# Altium schematic sheet Bandpass.SchDoc
size A
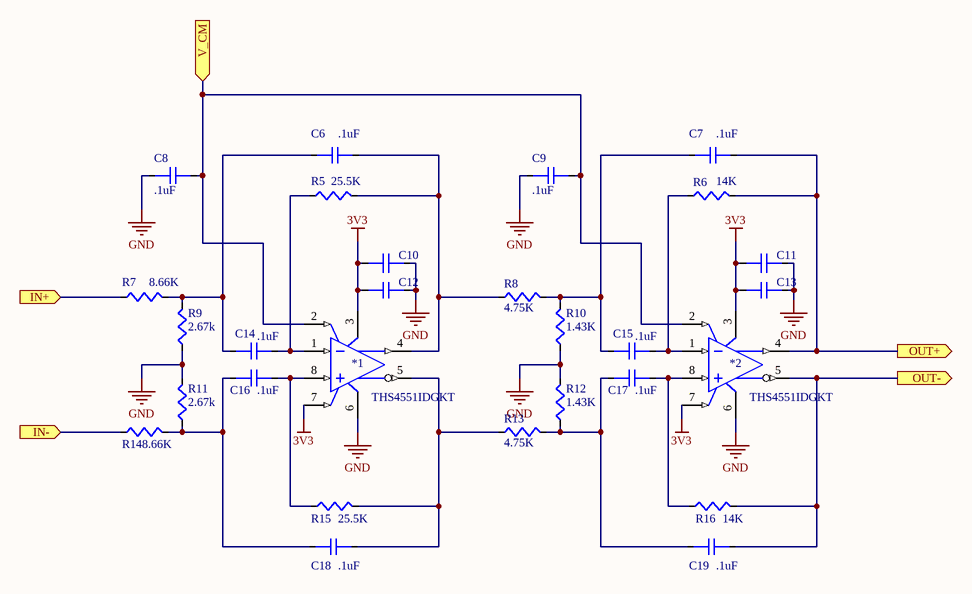
[diagram p0: Bandpass.SchDoc]

## Parts
*1  THS4551IDGKT
*2  THS4551IDGKT
C6  .1uF
C7  .1uF
C8  .1uF
C9  .1uF
C10  2.2uF  (value not drawn)
C11  2.2uF  (value not drawn)
C12  .1uF  (value not drawn)
C13  .1uF  (value not drawn)
C14  .1uF
C15  .1uF
C16  .1uF
C17  .1uF
C18  .1uF
C19  .1uF
R5  25.5K
R6  14K
R7  8.66K
R8  4.75K
R9  2.67k
R10  1.43K
R11  2.67k
R12  1.43K
R13  4.75K
R14  8.66K
R15  25.5K
R16  14K

## Ports
IN+ (in), IN- (in), OUT+ (out), OUT- (out), V_CM (in)

## Nets
3V3: *1.3(VS+) *1.7(~{PD}) *2.3(VS+) *2.7(~{PD}) C10.1 C11.1 C12.1 C13.1
GND: *1.6(VS-) *2.6(VS-) C8.1 C9.1 C10.2 C11.2 C12.2 C13.2 R9.1 R10.1 R11.2 R12.2
IN+: R7.1 ; port IN+
IN-: R14.1 ; port IN-
OUT+: *2.4(VOUT+) C7.2 R6.2 ; port OUT+
OUT-: *2.5(VOUT-) C19.2 R16.2 ; port OUT-
V_CM: *1.2(VOCM) *2.2(VOCM) C8.2 C9.2 ; port V_CM
Net*1_1: *1.1(VIN-) C14.2 R5.1
Net*1_4: *1.4(VOUT+) C6.2 R5.2 R8.1
Net*1_5: *1.5(VOUT-) C18.2 R13.1 R15.2
Net*1_8: *1.8(VIN+) C16.2 R15.1
Net*2_1: *2.1(VIN-) C15.2 R6.1
Net*2_8: *2.8(VIN+) C17.2 R16.1
NetC6_1: C6.1 C14.1 R7.2 R9.2
NetC7_1: C7.1 C15.1 R8.2 R10.2
NetC16_1: C16.1 C18.1 R11.1 R14.2
NetC17_1: C17.1 C19.1 R12.1 R13.2

## Library data of the parts
*1 *2 = THS4551IDGKT: Low Noise, Precision, 150MHz, Fully Differential Amplifier 8-VSSOP -40 to 125; Manufacturer 1: Texas Instruments; Number of Channels: 1; Slew Rate: 220V/µs; Output Current per Channel: 65mA; Gain Bandwidth Product: 135MHz; Input Bias Current: 1uA; Input Offset Voltage (Vos): 50uV; Operating Supply Current: 1.35mA; Supplier 1: Digi-Key; Supplier Part Number 1: 296-44771-1-ND; Manufacturer Part Number 1: THS4551IDGKT; Stock 1: 3028; Pricing 1: 1=3.84000, 10=3.44900, 100=2.82600 (USD); Mount: Surface Mount; Case/Package: VSSOP; Number of Pins: 8; Min Operating Temperature: -40°C; Max Operating Temperature: 125°C; -3db Bandwidth: 150MHz; Packaging: Cut Tape; Number of Circuits: 1; Number of Amplifiers: 1; Bandwidth: 135MHz; REACH SVHC: No SVHC; Lead Free: Lead Free; ComponentLink1URL: http://www.ti.com/lit/ds/symlink/ths4551.pdf?src-supplier=Digi-Key; ComponentLink1Description: http://www.ti.com/lit/ds/symlink/ths4551.pdf?src-supplier=Digi-Key; ComponentLink2URL: http://www.ti.com/general/docs/lit/getliterature.tsp?genericPartNumber=THS4551&fileType=pdf&src-supplier=Farnell; ComponentLink2Description: http://www.ti.com/general/docs/lit/getliterature.tsp?genericPartNumber=THS4551&fileType=pdf&src-supplier=Farnell; ComponentLink3URL: http://www.farnell.com/datasheets/2148327.pdf?src-supplier=Element14; ComponentLink3Description: http://www.farnell.com/datasheets/2148327.pdf?src-supplier=Element14; ComponentLink4URL: https://octopart.com/click/track?ai=2118&ct=datasheets&sig=0013830&at=physicalpart&sid=370&ppid=71776714&hlid=24961842&src-supplier=TI+store; ComponentLink4Description: https://octopart.com/click/track?ai=2118&ct=datasheets&sig=0013830&at=physicalpart&sid=370&ppid=71776714&hlid=24961842&src-supplier=TI+store; ComponentLink5URL: http://sigma.octopart.com/49250154/technical_drawing/Texas-Instruments-THS4551IDGKT.pdf?src-supplier=TI+store; ComponentLink5Description: http://sigma.octopart.com/49250154/technical_drawing/Texas-Instruments-THS4551IDGKT.pdf?src-supplier=TI+store; ComponentLink6URL: http://datasheet.octopart.com/THS4551IDGKT-Texas-Instruments-datasheet-78835010.pdf?src-supplier=Element14; ComponentLink6Description: http://datasheet.octopart.com/THS4551IDGKT-Texas-Instruments-datasheet-78835010.pdf?src-supplier=Element14; ComponentLink7URL: http://datasheet.octopart.com/THS4551IDGKT-Texas-Instruments-datasheet-67294894.pdf?src-supplier=Newark; ComponentLink7Description: http://datasheet.octopart.com/THS4551IDGKT-Texas-Instruments-datasheet-67294894.pdf?src-supplier=Newark
C6-C9 C12-C19 = VJ0603Y104JXJCW1BC: 0603 0.1 uF 16 V ±5 % Tolerance X7R SMT Multilayer Ceramic Chip Capacitor; Manufacturer 1: Vishay Vitramon; Dielectric Material: Tantalum; Tolerance: 5%; Capacitance: 100nF; Voltage Rating: 16V; Supplier 1: Digi-Key; Supplier Part Number 1: 720-1685-1-ND; Manufacturer Part Number 1: VJ0603Y104JXJCW1BC; Stock 1: 6936; Pricing 1: 1=0.20000, 10=0.13400, 100=0.06780, 500=0.04636, 1000=0.04101 (USD); RoHS: Yes; Mount: Surface Mount; Case/Package: 0603; Number of Pins: 2; Case Code (Imperial): 0603; Case Code (Metric): 1608; Contact Plating: Tin,Matte; Min Operating Temperature: -55°C; Max Operating Temperature: 125°C; Packaging: Tape and Reel; Voltage Rating (DC): 16V; Package Quantity: 4000; Dielectric: X7R; Termination: SMD/SMT; Length: 1.6mm; Height: 0.95mm; Width: 0.8mm; Depth: 0.8mm; Lead Free: Lead Free; ComponentLink1URL: https://datasheet.ciiva.com/5424/vjw1bcbascomseries-223529-5424533.pdf?src-supplier=Mouser; ComponentLink1Description: https://datasheet.ciiva.com/5424/vjw1bcbascomseries-223529-5424533.pdf?src-supplier=Mouser; ComponentLink2URL: https://datasheet.ciiva.com/11491/vjw1bcbascomseries-11491768.pdf?src-supplier=Avnet; ComponentLink2Description: https://datasheet.ciiva.com/11491/vjw1bcbascomseries-11491768.pdf?src-supplier=Avnet; ComponentLink3URL: https://datasheet.ciiva.com/16215/vjw1bcbascomseries-16215161.pdf?src-supplier=Future+Electronics; ComponentLink3Description: https://datasheet.ciiva.com/16215/vjw1bcbascomseries-16215161.pdf?src-supplier=Future+Electronics
C10 C11 = VJ0603Y224KXJCW1BC: Cap Ceramic 0.22uF 16V X7R 10% SMD 0603 125C Paper T/R; Manufacturer 1: Vishay Vitramon; Dielectric Material: Tantalum; Capacitance: 220nF; Supplier 1: Digi-Key; Supplier Part Number 1: 720-1853-1-ND; Manufacturer Part Number 1: VJ0603Y224KXJCW1BC; Stock 1: 890490; Pricing 1: 1=0.10000, 10=0.07000, 100=0.03100, 500=0.02214, 1000=0.01739 (USD); RoHS: Yes; Mount: Surface Mount; Case/Package: 0603; Min Operating Temperature: -55°C; Max Operating Temperature: 125°C; Tolerance: 10%; Packaging: Tape and Reel; Dielectric: X7R; Voltage Rating (DC): 16V; Length: 1.6mm; Depth: 0.8mm; Lead Free: Lead Free; ComponentLink1URL: https://datasheet.ciiva.com/11490/vjw1bcbascomseries-11490982.pdf?src-supplier=Avnet; ComponentLink1Description: https://datasheet.ciiva.com/11490/vjw1bcbascomseries-11490982.pdf?src-supplier=Avnet
R5 R15 = ERA-3AEB2552V: RESISTOR, 25K5, 0603, 0.1%, 0.1W; Manufacturer 1: Panasonic; Resistance: 25.5kR; Temperature Coefficient: 25ppm/°C; Voltage Rating: 75V; Power Rating: 100mW; Supplier 1: Digi-Key; Supplier Part Number 1: P25.5KDBCT-ND; Manufacturer Part Number 1: ERA-3AEB2552V; Stock 1: 16750; Pricing 1: 1=0.35000, 10=0.30000, 100=0.11720, 1000=0.04906, 2500=0.04498 (USD); RoHS: Yes; Mount: Surface Mount; Case/Package: 0603; Number of Pins: 2; Contact Plating: Tin; Case Code (Metric): 1608; Case Code (Imperial): 0603; Min Operating Temperature: -55°C; Max Operating Temperature: 155°C; Tolerance: 0.1%; Composition: Thin Film,Metal Film; Packaging: Tape and Reel; Package Quantity: 5000; Number of Terminations: 2; Termination: SMD/SMT; Max Power Dissipation: 100mW; Voltage Rating (DC): 75V; Features: Automotive AEC-Q200; Length: 1.6mm; Height: 0.45mm; Width: 0.8mm; Depth: 0.8mm; Radiation Hardening: No; Lead Free: Lead Free; ComponentLink1URL: https://datasheet.ciiva.com/11814/0900766b80eb1d8c-11814802.pdf?src-supplier=RSComponents; ComponentLink1Description: https://datasheet.ciiva.com/11814/0900766b80eb1d8c-11814802.pdf?src-supplier=RSComponents; ComponentLink2URL: https://datasheet.ciiva.com/5987/485442-5987144.pdf?src-supplier=Farnell; ComponentLink2Description: https://datasheet.ciiva.com/5987/485442-5987144.pdf?src-supplier=Farnell; ComponentLink3URL: https://datasheet.ciiva.com/9191/aoa0000ce26-9191420.pdf?src-supplier=Avnet; ComponentLink3Description: https://datasheet.ciiva.com/9191/aoa0000ce26-9191420.pdf?src-supplier=Avnet; ComponentLink4URL: https://datasheet.ciiva.com/17210/aoa0000ce26-17210701.pdf?src-supplier=Avnet+Europe; ComponentLink4Description: https://datasheet.ciiva.com/17210/aoa0000ce26-17210701.pdf?src-supplier=Avnet+Europe; ComponentLink5URL: https://datasheet.ciiva.com/5987/485442-5987151.pdf?src-supplier=Farnell; ComponentLink5Description: https://datasheet.ciiva.com/5987/485442-5987151.pdf?src-supplier=Farnell; ComponentLink6URL: https://datasheet.ciiva.com/7870/485442-7870559.pdf?src-supplier=Element14; ComponentLink6Description: https://datasheet.ciiva.com/7870/485442-7870559.pdf?src-supplier=Element14
R6 R16 = TNPW060314K0BEEA: Res Thin Film 0603 14K Ohm 0.1% 1/10W ±25ppm/°C Molded SMD SMD Paper T/R; Manufacturer 1: Vishay Dale; Resistance: 14kR; Power Rating: 100mW; Voltage Rating: 75V; Voltage Rating (DC): 50V; Supplier 1: Digi-Key; Supplier Part Number 1: TNP14.0KAACT-ND; Manufacturer Part Number 1: TNPW060314K0BEEA; Stock 1: 9106; Pricing 1: 1=0.65000, 10=0.46200, 100=0.24020, 1000=0.12936, 2500=0.12760 (USD); RoHS: Yes; Mount: Surface Mount; Case/Package: 0603; Weight: 7.1E-05oz; Case Code (Metric): 1608; Case Code (Imperial): 0603; Contact Plating: Tin; Min Operating Temperature: -55°C; Max Operating Temperature: 125°C; Package Quantity: 1; Tolerance: 0.1%; Packaging: Tape and Reel; Composition: Thin Film; Number of Terminations: 2; Termination: SMD/SMT; Military Standard: Not; Max Power Dissipation: 100mW; Temperature Coefficient: 25ppm/°C; Features: Moisture Resistant,Automotive AEC-Q200,Anti-Sulfur; Length: 1.6mm; Height: 0.45mm; Width: 0.033inch; Depth: 0.85mm; Radiation Hardening: No; REACH SVHC: Unknown; Lead Free: Lead Free; ComponentLink1URL: https://datasheet.ciiva.com/2483/tnpw-e3-2483298.pdf?src-supplier=Digi-Key; ComponentLink1Description: https://datasheet.ciiva.com/2483/tnpw-e3-2483298.pdf?src-supplier=Digi-Key; ComponentLink2URL: https://datasheet.ciiva.com/2483/tnpw-e3-2483299.pdf?src-supplier=Digi-Key; ComponentLink2Description: https://datasheet.ciiva.com/2483/tnpw-e3-2483299.pdf?src-supplier=Digi-Key; ComponentLink3URL: https://datasheet.ciiva.com/2483/tnpw-e3-2483300.pdf?src-supplier=Digi-Key; ComponentLink3Description: https://datasheet.ciiva.com/2483/tnpw-e3-2483300.pdf?src-supplier=Digi-Key; ComponentLink4URL: https://datasheet.ciiva.com/16391/tnpw-e3-16391669.pdf?src-supplier=Future+Electronics; ComponentLink4Description: https://datasheet.ciiva.com/16391/tnpw-e3-16391669.pdf?src-supplier=Future+Electronics; ComponentLink5URL: https://datasheet.ciiva.com/7743/tnpw-e3-7743801.pdf?src-supplier=Element14; ComponentLink5Description: https://datasheet.ciiva.com/7743/tnpw-e3-7743801.pdf?src-supplier=Element14; ComponentLink6URL: https://datasheet.ciiva.com/9041/tnpw-e3-9041772.pdf?src-supplier=Avnet; ComponentLink6Description: https://datasheet.ciiva.com/9041/tnpw-e3-9041772.pdf?src-supplier=Avnet
R7 R14 = TNPW06038K66BEEA: RES 8.66K OHM 1/10W 0.1% 0603; Manufacturer 1: Vishay Dale; Resistance: 8.66kR; Power Rating: 100mW; Voltage Rating: 75V; Temperature Coefficient: 25ppm/°C; Voltage Rating (DC): 50V; Supplier 1: Digi-Key; Supplier Part Number 1: 541-2053-1-ND; Manufacturer Part Number 1: TNPW06038K66BEEA; Stock 1: 5343; Pricing 1: 1=0.65000, 10=0.46200, 100=0.24020, 1000=0.12936, 2500=0.12760 (USD); RoHS: Yes; Mount: Surface Mount; Case/Package: 0603; Weight: 7.1E-05oz; Case Code (Metric): 1608; Case Code (Imperial): 0603; Contact Plating: Tin; Min Operating Temperature: -55°C; Max Operating Temperature: 125°C; Tolerance: 0.1%; Package Quantity: 5000; Packaging: Tape and Reel; Composition: Thin Film; Number of Terminations: 2; Termination: SMD/SMT; Military Standard: Not; Max Power Dissipation: 100mW; Features: Automotive AEC-Q200,Moisture Resistant,Anti-Sulfur; Length: 1.6mm; Height: 0.022inch; Width: 0.033inch; Depth: 0.85mm; Radiation Hardening: No; REACH SVHC: Unknown; Lead Free: Lead Free; ComponentLink1URL: https://datasheet.ciiva.com/9055/tnpw-e3-9055061.pdf?src-supplier=Avnet; ComponentLink1Description: https://datasheet.ciiva.com/9055/tnpw-e3-9055061.pdf?src-supplier=Avnet; ComponentLink2URL: https://datasheet.ciiva.com/41816/tnpw-e3-41816622.pdf?src-supplier=Digi-Key; ComponentLink2Description: https://datasheet.ciiva.com/41816/tnpw-e3-41816622.pdf?src-supplier=Digi-Key; ComponentLink3URL: https://datasheet.ciiva.com/2603/tnpw-e3-2603713.pdf?src-supplier=Digi-Key; ComponentLink3Description: https://datasheet.ciiva.com/2603/tnpw-e3-2603713.pdf?src-supplier=Digi-Key
R8 R13 = TNPW06034K75BEEA: Res Thin Film 0603 4.75K Ohm 0.1% 1/10W ±25ppm/°C Molded SMD SMD Paper T/R; Manufacturer 1: Vishay Dale; Resistance: 4.75kR; Power Rating: 100mW; Voltage Rating: 75V; Voltage Rating (DC): 50V; Supplier 1: Digi-Key; Supplier Part Number 1: TNP4.75KAACT-ND; Manufacturer Part Number 1: TNPW06034K75BEEA; Stock 1: 10015; Pricing 1: 1=0.65000, 10=0.46200, 100=0.24020, 1000=0.12936, 2500=0.12760 (USD); RoHS: Yes; Case/Package: 0603; Weight: 7.1E-05oz; Case Code (Metric): 1608; Case Code (Imperial): 0603; Contact Plating: Tin; Min Operating Temperature: -55°C; Max Operating Temperature: 125°C; Tolerance: 0.1%; Packaging: Tape and Reel; Package Quantity: 1; Composition: Thin Film; Number of Terminations: 2; Termination: SMD/SMT; Military Standard: Not; Temperature Coefficient: 25ppm/°C; Max Power Dissipation: 100mW; Features: Moisture Resistant,Automotive AEC-Q200,Anti-Sulfur; Length: 1.6mm; Height: 0.45mm; Width: 0.033inch; Depth: 0.85mm; Radiation Hardening: No; REACH SVHC: Unknown; Lead Free: Lead Free; ComponentLink1URL: https://datasheet.ciiva.com/9070/tnpw-e3-9070279.pdf?src-supplier=Avnet; ComponentLink1Description: https://datasheet.ciiva.com/9070/tnpw-e3-9070279.pdf?src-supplier=Avnet; ComponentLink2URL: https://datasheet.ciiva.com/2483/tnpw-e3-2483244.pdf?src-supplier=Digi-Key; ComponentLink2Description: https://datasheet.ciiva.com/2483/tnpw-e3-2483244.pdf?src-supplier=Digi-Key; ComponentLink3URL: https://datasheet.ciiva.com/7743/tnpw-e3-7743820.pdf?src-supplier=Element14; ComponentLink3Description: https://datasheet.ciiva.com/7743/tnpw-e3-7743820.pdf?src-supplier=Element14; ComponentLink4URL: https://datasheet.ciiva.com/2483/tnpw-e3-2483245.pdf?src-supplier=Digi-Key; ComponentLink4Description: https://datasheet.ciiva.com/2483/tnpw-e3-2483245.pdf?src-supplier=Digi-Key; ComponentLink5URL: https://datasheet.ciiva.com/2483/tnpw-e3-2483246.pdf?src-supplier=Digi-Key; ComponentLink5Description: https://datasheet.ciiva.com/2483/tnpw-e3-2483246.pdf?src-supplier=Digi-Key
R9 R11 = TNPW06032K67BEEA: RES SMD 2.67KOHM 0.1% 1/10W 0603; Manufacturer 1: Vishay Dale; Resistance: 2.67kR; Power Rating: 100mW; Voltage Rating: 75V; Temperature Coefficient: 25ppm/°C; Voltage Rating (DC): 50V; Supplier 1: Digi-Key; Supplier Part Number 1: 541-3645-1-ND; Manufacturer Part Number 1: TNPW06032K67BEEA; Stock 1: 10082; Pricing 1: 1=0.65000, 10=0.46200, 100=0.24020, 1000=0.12936, 2500=0.12760 (USD); RoHS: Yes; Case/Package: 0603; Case Code (Metric): 1608; Case Code (Imperial): 0603; Contact Plating: Tin; Min Operating Temperature: -55°C; Max Operating Temperature: 125°C; Packaging: Tape and Reel; Tolerance: 0.1%; Package Quantity: 5000; Composition: Thin Film; Number of Terminations: 2; Termination: SMD/SMT; Max Power Dissipation: 100mW; Features: Moisture Resistant,Automotive AEC-Q200,Anti-Sulfur; Length: 0.063inch; Height: 0.022inch; Width: 0.033inch; Radiation Hardening: No; REACH SVHC: Unknown; ComponentLink1URL: https://datasheet.ciiva.com/2603/tnpw-e3-2603660.pdf?src-supplier=Digi-Key; ComponentLink1Description: https://datasheet.ciiva.com/2603/tnpw-e3-2603660.pdf?src-supplier=Digi-Key; Supplier 2: Digi-Key; Supplier Part Number 2: P25.5KDBCT-ND
R10 R12 = TNPW06031K43BEEA: Res Thin Film 0603 1.43K Ohm 0.1% 1/10W ±25ppm/°C Molded SMD SMD Paper T/R; Manufacturer 1: Vishay Dale; Resistance: 1.43kR; Power Rating: 100mW; Voltage Rating: 75V; Voltage Rating (DC): 50V; Supplier 1: Digi-Key; Supplier Part Number 1: TNPW06031K43BEEA-ND; Manufacturer Part Number 1: TNPW06031K43BEEA; Stock 1: 0; Pricing 1: 5000=0.11600 (USD); RoHS: Yes; Case/Package: 0603; Weight: 7.1E-05oz; Case Code (Metric): 1608; Case Code (Imperial): 0603; Contact Plating: Tin; Min Operating Temperature: -55°C; Max Operating Temperature: 125°C; Package Quantity: 5000; Packaging: Tape and Reel; Tolerance: 0.1%; Composition: Thin Film; Number of Terminations: 2; Termination: SMD/SMT; Max Power Dissipation: 100mW; Temperature Coefficient: 25ppm/°C; Features: Moisture Resistant,Automotive AEC-Q200,Anti-Sulfur; Length: 0.063inch; Height: 0.022inch; Width: 0.033inch; Radiation Hardening: No; REACH SVHC: Unknown; ComponentLink1URL: https://datasheet.ciiva.com/2603/tnpw-e3-2603635.pdf?src-supplier=Digi-Key; ComponentLink1Description: https://datasheet.ciiva.com/2603/tnpw-e3-2603635.pdf?src-supplier=Digi-Key; ComponentLink2URL: https://datasheet.ciiva.com/9101/tnpw-e3-9101995.pdf?src-supplier=Avnet; ComponentLink2Description: https://datasheet.ciiva.com/9101/tnpw-e3-9101995.pdf?src-supplier=Avnet